# Altium schematic sheet Basic Power Supply.schdoc: Basic Power Supply
size A4; Organization: Altium Limited; Address1: L3, 12a Rodborough Rd; Address2: Frenchs Forest; Address3: NSW; Address4: Australia 2086; DocumentNumber: 1; SheetNumber: 1; SheetTotal: 1
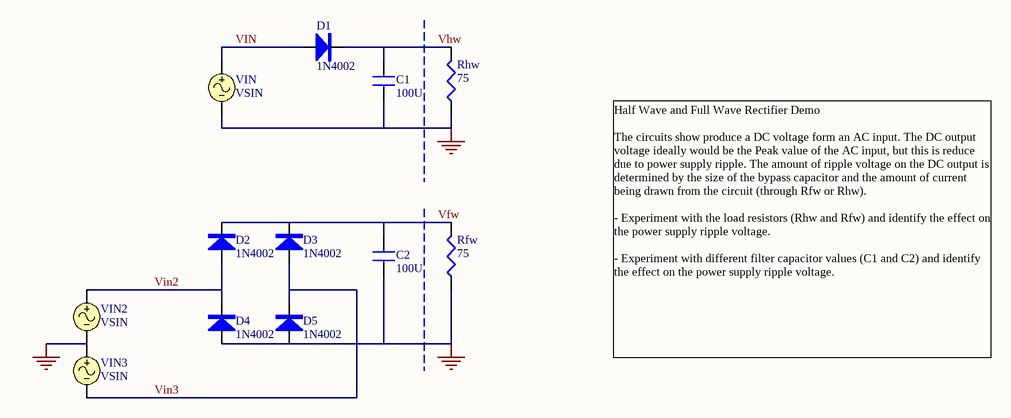
[diagram p0: Basic Power Supply.schdoc]

## Parts
C1  100U
C2  100U
D1  1N4002
D2  1N4002
D3  1N4002
D4  1N4002
D5  1N4002
Rfw  75
Rhw  75
VIN  VSIN
VIN2  VSIN
VIN3  VSIN

## Nets
GND: C1.1 C2.2 D4.1(A) D5.1(A) Rfw.2(BOT) Rhw.2(BOT) VIN.2 VIN2.2 VIN3.1
Vfw: C2.1 D2.2(K) D3.2(K) Rfw.1(TOP)
Vhw: C1.2 D1.2(K) Rhw.1(TOP)
VIN: D1.1(A) VIN.1
Vin2: D2.1(A) D4.2(K) VIN2.1
Vin3: D3.1(A) D5.2(K) VIN3.2

## Notes on the sheet
- Half Wave and Full Wave Rectifier Demo
  The circuits show produce a DC voltage form an AC input. The DC output voltage ideally would be the Peak value of the AC input, but this is reduce due to power supply ripple. The amount of ripple voltage on the DC output is determined by the size of the bypass capacitor and the amount of current being drawn from the circuit (through Rfw or Rhw).
  - Experiment with the load resistors (Rhw and Rfw) and identify the effect on the power supply ripple voltage.
  - Experiment with different filter capacitor values (C1 and C2) and identify the effect on the power supply ripple voltage.
- Title
- Size:
- Date:
- A4
- Number:
- Time:
- Revision:
- Sheet
- of
- File:

## Library data of the parts
C1 C2 = CAP: Capacitor; Value: 100U
D1-D5 = 1N4002: Diode
Rfw Rhw = RES: Resistor; Part Field 1: 0; Value: 75
VIN VIN2 VIN3 = VSIN: Sinusoidal Voltage Source